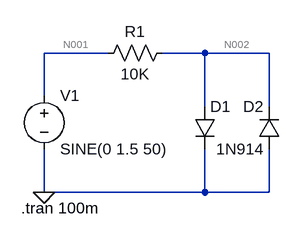
[diagram p0: schematic Draft2.asc]
Draft2.asc, the LTspice schematic file:
Version 4
SHEET 1 880 680
WIRE 192 176 96 176
WIRE 336 176 272 176
WIRE 432 176 336 176
WIRE 96 240 96 176
WIRE 336 256 336 176
WIRE 432 256 432 176
WIRE 96 384 96 320
WIRE 336 384 336 320
WIRE 336 384 96 384
WIRE 432 384 432 320
WIRE 432 384 336 384
FLAG 96 384 0
SYMBOL voltage 96 224 R0
WINDOW 123 0 0 Left 0
WINDOW 39 0 0 Left 0
SYMATTR InstName V1
SYMATTR Value SINE(0 1.5 50)
SYMBOL res 288 160 R90
WINDOW 0 0 56 VBottom 2
WINDOW 3 32 56 VTop 2
SYMATTR InstName R1
SYMATTR Value 10K
SYMBOL diode 320 256 R0
WINDOW 3 24 64 Invisible 2
SYMATTR Value 1N914
SYMATTR InstName D1
SYMBOL diode 448 320 R180
WINDOW 0 24 64 Left 2
WINDOW 3 24 0 Left 2
SYMATTR InstName D2
SYMATTR Value 1N914
TEXT 62 408 Left 2 !.tran 100m

The netlist it stands for:
* Draft2.asc
V1 N001 0 SINE(0 1.5 50)
R1 N002 N001 10K
D1 N002 0 1N914
D2 0 N002 1N914
.model D D
.lib standard.dio
.tran 100m
.backanno
.end

* Results of the author's LTspice run, read from the files saved beside the schematic
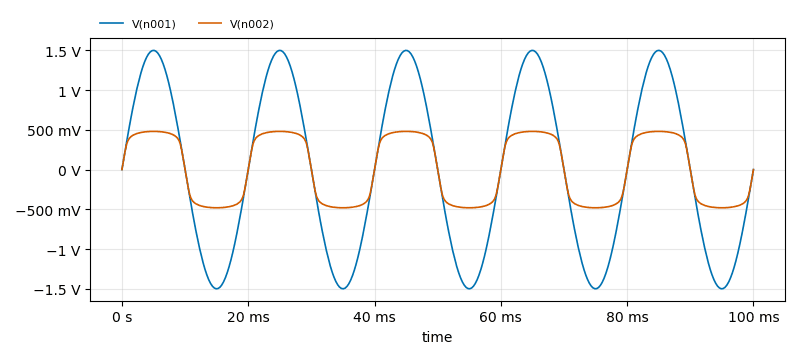
[diagram p1: Transient Analysis of Draft2.asc, plotted from the saved traces]
* Transient Analysis, 1 run:
*   V(n001): min -1.5 V, max 1.5 V, average -1.912 µV, rms 1.06 V, last 0 V
*   V(n002): min -480.7 mV, max 480.7 mV, average -2.181 µV, rms 422.5 mV, last -37.5 µV